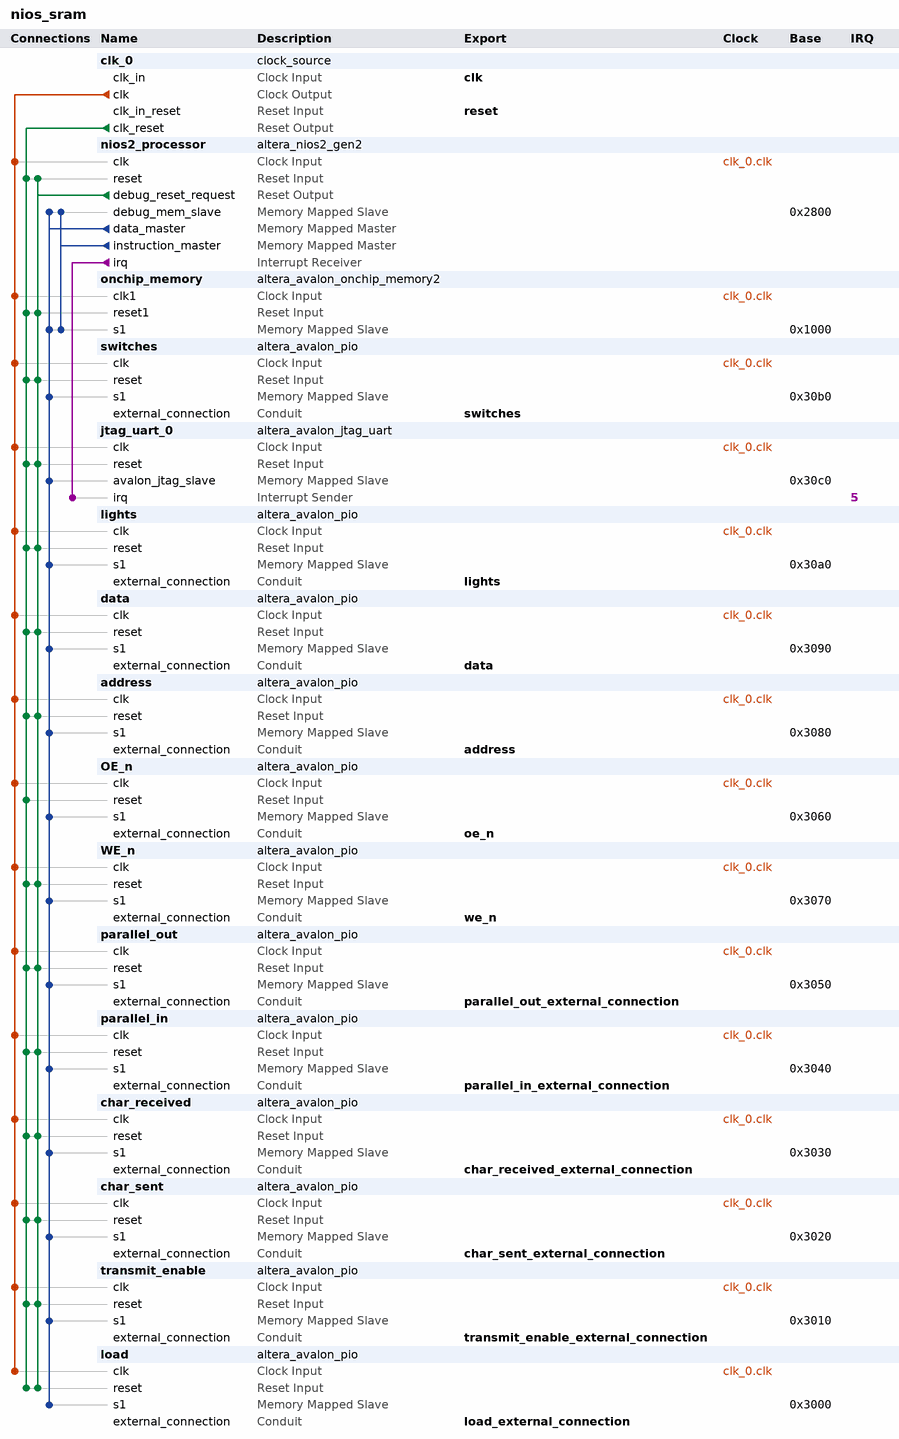
[diagram p0: system contents]
# Platform Designer (Qsys) system nios_sram, Cyclone V 5CSEMA5F31C6
# Parameters at their usual value, and those the tool derives, are not listed.
package require -exact qsys 15.1
create_system nios_sram
set_project_property DEVICE_FAMILY {Cyclone V}
set_project_property DEVICE 5CSEMA5F31C6

add_instance clk_0 clock_source 15.1
set_instance_parameter_value clk_0 clockFrequency 50000000

add_instance nios2_processor altera_nios2_gen2 15.1
set_instance_parameter_value nios2_processor dcache_size 2048
set_instance_parameter_value nios2_processor exceptionSlave onchip_memory.s1
set_instance_parameter_value nios2_processor icache_size 4096
set_instance_parameter_value nios2_processor impl Tiny
set_instance_parameter_value nios2_processor resetSlave onchip_memory.s1

add_instance onchip_memory altera_avalon_onchip_memory2 15.1
set_instance_parameter_value onchip_memory dataWidth 32
set_instance_parameter_value onchip_memory dualPort false
set_instance_parameter_value onchip_memory initMemContent true
set_instance_parameter_value onchip_memory initializationFileName onchip_mem.hex
set_instance_parameter_value onchip_memory memorySize 4096

add_instance switches altera_avalon_pio 15.1
set_instance_parameter_value switches direction Input
set_instance_parameter_value switches width 8

add_instance jtag_uart_0 altera_avalon_jtag_uart 15.1
set_instance_parameter_value jtag_uart_0 simInteractiveOptions NO_INTERACTIVE_WINDOWS

add_instance lights altera_avalon_pio 15.1
set_instance_parameter_value lights direction Output
set_instance_parameter_value lights width 8

add_instance data altera_avalon_pio 15.1
set_instance_parameter_value data direction Bidir
set_instance_parameter_value data width 8

add_instance address altera_avalon_pio 15.1
set_instance_parameter_value address direction Output
set_instance_parameter_value address width 11

add_instance OE_n altera_avalon_pio 15.1
set_instance_parameter_value OE_n direction Output
set_instance_parameter_value OE_n width 1

add_instance WE_n altera_avalon_pio 15.1
set_instance_parameter_value WE_n direction Output
set_instance_parameter_value WE_n width 1

add_instance parallel_out altera_avalon_pio 15.1
set_instance_parameter_value parallel_out direction Output
set_instance_parameter_value parallel_out width 8

add_instance parallel_in altera_avalon_pio 15.1
set_instance_parameter_value parallel_in direction Input
set_instance_parameter_value parallel_in width 8

add_instance char_received altera_avalon_pio 15.1
set_instance_parameter_value char_received direction Input
set_instance_parameter_value char_received width 1

add_instance char_sent altera_avalon_pio 15.1
set_instance_parameter_value char_sent direction Input
set_instance_parameter_value char_sent width 1

add_instance transmit_enable altera_avalon_pio 15.1
set_instance_parameter_value transmit_enable direction Output
set_instance_parameter_value transmit_enable width 1

add_instance load altera_avalon_pio 15.1
set_instance_parameter_value load direction Output
set_instance_parameter_value load width 1

# connections
add_connection clk_0.clk address.clk clock
add_connection clk_0.clk char_received.clk clock
add_connection clk_0.clk char_sent.clk clock
add_connection clk_0.clk data.clk clock
add_connection clk_0.clk jtag_uart_0.clk clock
add_connection clk_0.clk lights.clk clock
add_connection clk_0.clk load.clk clock
add_connection clk_0.clk nios2_processor.clk clock
add_connection clk_0.clk OE_n.clk clock
add_connection clk_0.clk onchip_memory.clk1 clock
add_connection clk_0.clk parallel_in.clk clock
add_connection clk_0.clk parallel_out.clk clock
add_connection clk_0.clk switches.clk clock
add_connection clk_0.clk transmit_enable.clk clock
add_connection clk_0.clk WE_n.clk clock
add_connection clk_0.clk_reset address.reset reset
add_connection clk_0.clk_reset char_received.reset reset
add_connection clk_0.clk_reset char_sent.reset reset
add_connection clk_0.clk_reset data.reset reset
add_connection clk_0.clk_reset jtag_uart_0.reset reset
add_connection clk_0.clk_reset lights.reset reset
add_connection clk_0.clk_reset load.reset reset
add_connection clk_0.clk_reset nios2_processor.reset reset
add_connection clk_0.clk_reset OE_n.reset reset
add_connection clk_0.clk_reset onchip_memory.reset1 reset
add_connection clk_0.clk_reset parallel_in.reset reset
add_connection clk_0.clk_reset parallel_out.reset reset
add_connection clk_0.clk_reset switches.reset reset
add_connection clk_0.clk_reset transmit_enable.reset reset
add_connection clk_0.clk_reset WE_n.reset reset
add_connection nios2_processor.debug_reset_request address.reset reset
add_connection nios2_processor.debug_reset_request char_received.reset reset
add_connection nios2_processor.debug_reset_request char_sent.reset reset
add_connection nios2_processor.debug_reset_request data.reset reset
add_connection nios2_processor.debug_reset_request jtag_uart_0.reset reset
add_connection nios2_processor.debug_reset_request lights.reset reset
add_connection nios2_processor.debug_reset_request load.reset reset
add_connection nios2_processor.debug_reset_request nios2_processor.reset reset
add_connection nios2_processor.debug_reset_request onchip_memory.reset1 reset
add_connection nios2_processor.debug_reset_request parallel_in.reset reset
add_connection nios2_processor.debug_reset_request parallel_out.reset reset
add_connection nios2_processor.debug_reset_request switches.reset reset
add_connection nios2_processor.debug_reset_request transmit_enable.reset reset
add_connection nios2_processor.debug_reset_request WE_n.reset reset
add_connection nios2_processor.data_master address.s1 avalon
set_connection_parameter_value nios2_processor.data_master/address.s1 baseAddress 0x3080
add_connection nios2_processor.data_master char_received.s1 avalon
set_connection_parameter_value nios2_processor.data_master/char_received.s1 baseAddress 0x3030
add_connection nios2_processor.data_master char_sent.s1 avalon
set_connection_parameter_value nios2_processor.data_master/char_sent.s1 baseAddress 0x3020
add_connection nios2_processor.data_master data.s1 avalon
set_connection_parameter_value nios2_processor.data_master/data.s1 baseAddress 0x3090
add_connection nios2_processor.data_master jtag_uart_0.avalon_jtag_slave avalon
set_connection_parameter_value nios2_processor.data_master/jtag_uart_0.avalon_jtag_slave baseAddress 0x30c0
add_connection nios2_processor.data_master lights.s1 avalon
set_connection_parameter_value nios2_processor.data_master/lights.s1 baseAddress 0x30a0
add_connection nios2_processor.data_master load.s1 avalon
set_connection_parameter_value nios2_processor.data_master/load.s1 baseAddress 0x3000
add_connection nios2_processor.data_master nios2_processor.debug_mem_slave avalon
set_connection_parameter_value nios2_processor.data_master/nios2_processor.debug_mem_slave baseAddress 0x2800
add_connection nios2_processor.data_master OE_n.s1 avalon
set_connection_parameter_value nios2_processor.data_master/OE_n.s1 baseAddress 0x3060
add_connection nios2_processor.data_master onchip_memory.s1 avalon
set_connection_parameter_value nios2_processor.data_master/onchip_memory.s1 baseAddress 0x1000
add_connection nios2_processor.data_master parallel_in.s1 avalon
set_connection_parameter_value nios2_processor.data_master/parallel_in.s1 baseAddress 0x3040
add_connection nios2_processor.data_master parallel_out.s1 avalon
set_connection_parameter_value nios2_processor.data_master/parallel_out.s1 baseAddress 0x3050
add_connection nios2_processor.data_master switches.s1 avalon
set_connection_parameter_value nios2_processor.data_master/switches.s1 baseAddress 0x30b0
add_connection nios2_processor.data_master transmit_enable.s1 avalon
set_connection_parameter_value nios2_processor.data_master/transmit_enable.s1 baseAddress 0x3010
add_connection nios2_processor.data_master WE_n.s1 avalon
set_connection_parameter_value nios2_processor.data_master/WE_n.s1 baseAddress 0x3070
add_connection nios2_processor.instruction_master nios2_processor.debug_mem_slave avalon
set_connection_parameter_value nios2_processor.instruction_master/nios2_processor.debug_mem_slave baseAddress 0x2800
add_connection nios2_processor.instruction_master onchip_memory.s1 avalon
set_connection_parameter_value nios2_processor.instruction_master/onchip_memory.s1 baseAddress 0x1000
add_connection nios2_processor.irq jtag_uart_0.irq interrupt
set_connection_parameter_value nios2_processor.irq/jtag_uart_0.irq irqNumber 5

# exported interfaces
add_interface address conduit end
set_interface_property address EXPORT_OF address.external_connection
add_interface char_received_external_connection conduit end
set_interface_property char_received_external_connection EXPORT_OF char_received.external_connection
add_interface char_sent_external_connection conduit end
set_interface_property char_sent_external_connection EXPORT_OF char_sent.external_connection
add_interface clk clock sink
set_interface_property clk EXPORT_OF clk_0.clk_in
add_interface data conduit end
set_interface_property data EXPORT_OF data.external_connection
add_interface lights conduit end
set_interface_property lights EXPORT_OF lights.external_connection
add_interface load_external_connection conduit end
set_interface_property load_external_connection EXPORT_OF load.external_connection
add_interface oe_n conduit end
set_interface_property oe_n EXPORT_OF OE_n.external_connection
add_interface parallel_in_external_connection conduit end
set_interface_property parallel_in_external_connection EXPORT_OF parallel_in.external_connection
add_interface parallel_out_external_connection conduit end
set_interface_property parallel_out_external_connection EXPORT_OF parallel_out.external_connection
add_interface reset reset sink
set_interface_property reset EXPORT_OF clk_0.clk_in_reset
add_interface switches conduit end
set_interface_property switches EXPORT_OF switches.external_connection
add_interface transmit_enable_external_connection conduit end
set_interface_property transmit_enable_external_connection EXPORT_OF transmit_enable.external_connection
add_interface we_n conduit end
set_interface_property we_n EXPORT_OF WE_n.external_connection

set_interconnect_requirement {$system} qsys_mm.clockCrossingAdapter HANDSHAKE
set_interconnect_requirement {$system} qsys_mm.enableEccProtection FALSE
set_interconnect_requirement {$system} qsys_mm.insertDefaultSlave FALSE
set_interconnect_requirement {$system} qsys_mm.maxAdditionalLatency 1

save_system nios_sram.qsys
